# EAGLE design G803X (EAGLE 6.6.0)
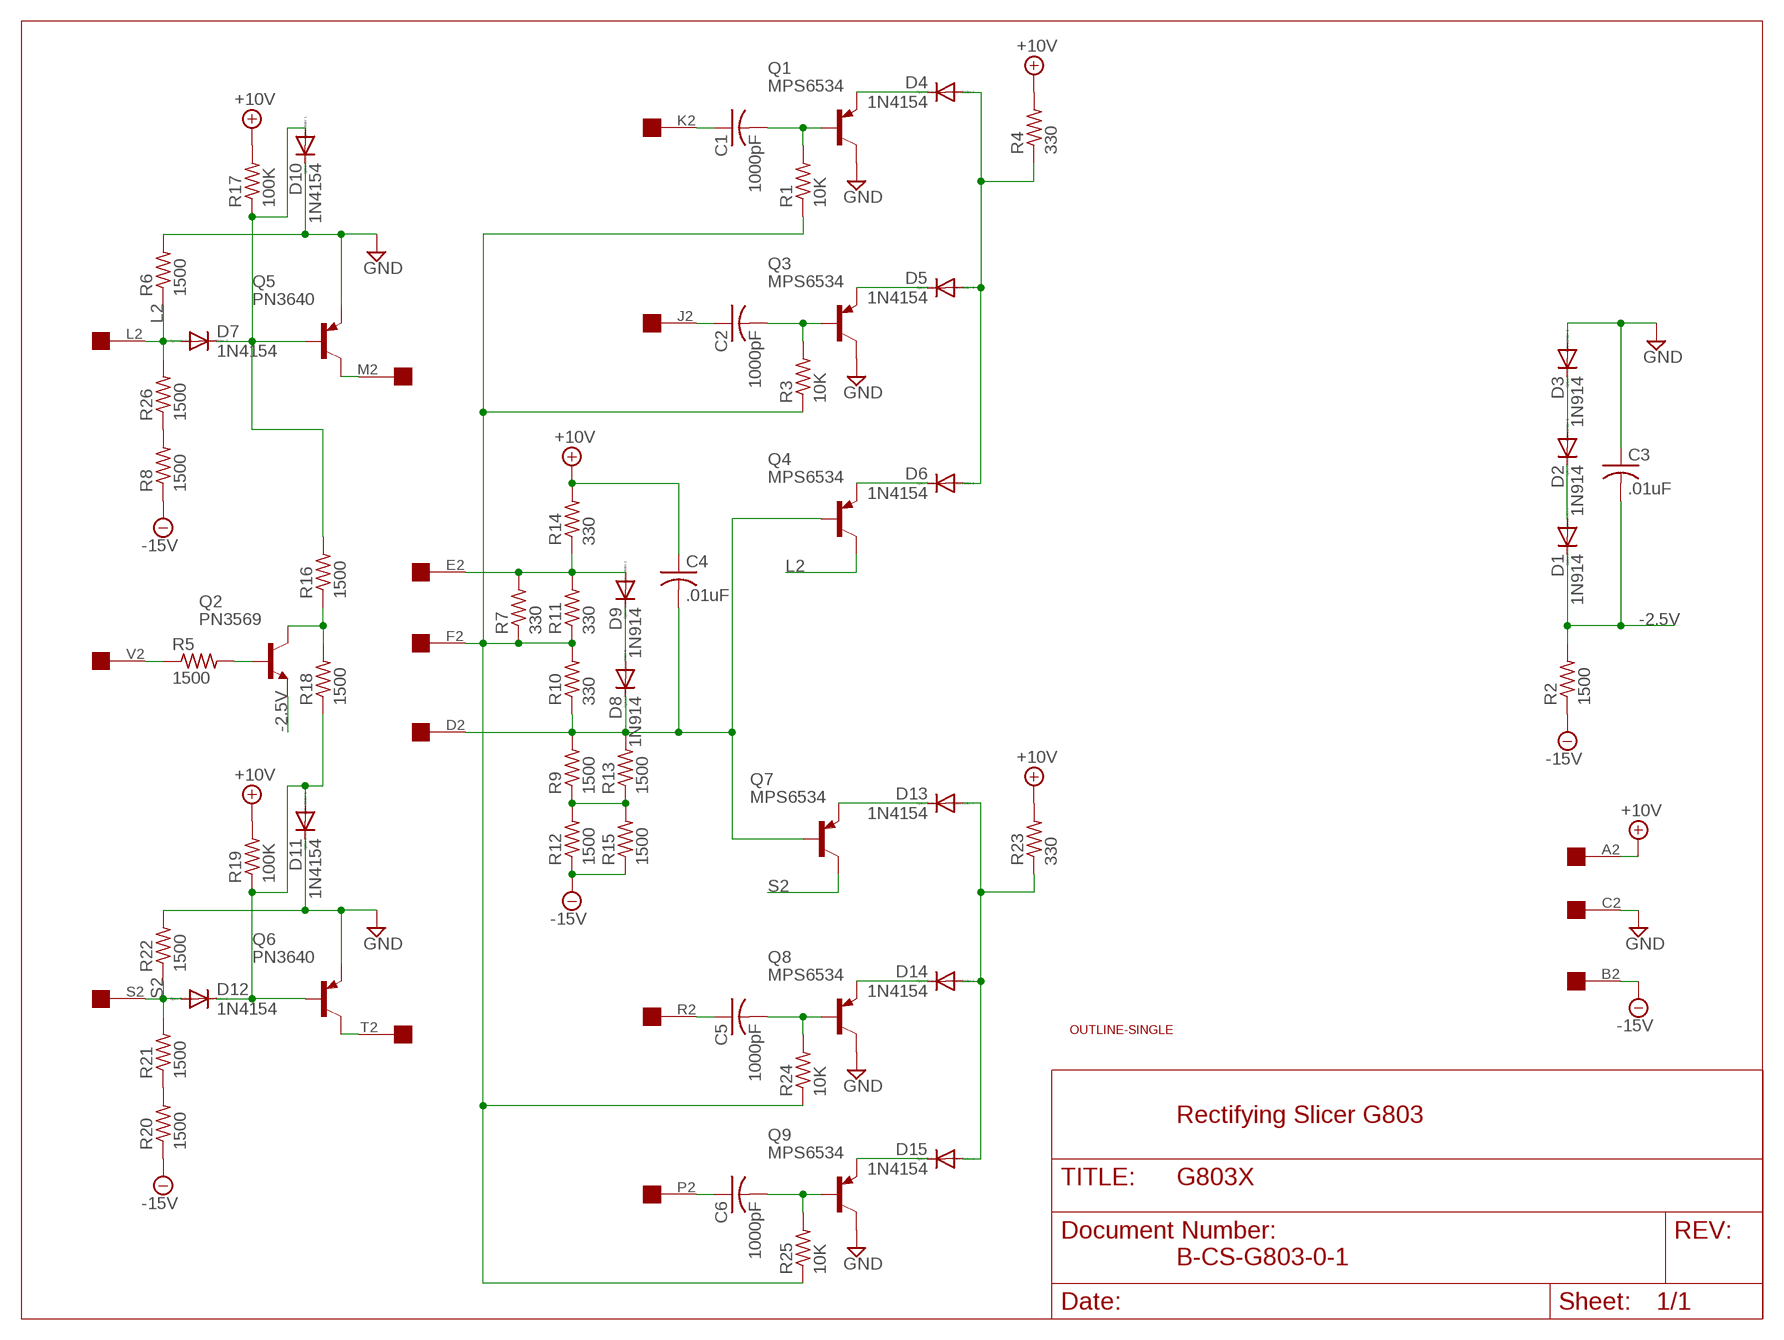
[diagram p0: schematic, sheet 1]

## Parts
C1  1000pF  C-US075-032X103  [C075-032X103]
C2  1000pF  C-US075-032X103  [C075-032X103]
C3  .01uF  C-US050-025X075  [C050-025X075]
C4  .01uF  C-US075-032X103  [C075-032X103]
C5  1000pF  C-US075-032X103  [C075-032X103]
C6  1000pF  C-US075-032X103  [C075-032X103]
D1  1N914  1N4148DO35-10  [DO35-10]
D2  1N914  1N4148DO35-10  [DO35-10]
D3  1N914  1N4148DO35-10  [DO35-10]
D4  1N4154  1N4148DO35-10  [DO35-10]
D5  1N4154  1N4148DO35-10  [DO35-10]
D6  1N4154  1N4148DO35-10  [DO35-10]
D7  1N4154  1N4148DO35-10  [DO35-10]
D8  1N914  1N4148DO35-10  [DO35-10]
D9  1N914  1N4148DO35-10  [DO35-10]
D10  1N4154  1N4148DO35-10  [DO35-10]
D11  1N4154  1N4148DO35-10  [DO35-10]
D12  1N4154  1N4148DO35-10  [DO35-10]
D13  1N4154  1N4148DO35-10  [DO35-10]
D14  1N4154  1N4148DO35-10  [DO35-10]
D15  1N4154  1N4148DO35-10  [DO35-10]
Q1  MPS6534  2N2904  [TO39]
Q2  PN3569  2N2102  [TO5]
Q3  MPS6534  2N2904  [TO39]
Q4  MPS6534  2N2904  [TO39]
Q5  PN3640  2N2904  [TO39]
Q6  PN3640  2N2904  [TO39]
Q7  MPS6534  2N2904  [TO39]
Q8  MPS6534  2N2904  [TO39]
Q9  MPS6534  2N2904  [TO39]
R1  10K  R-US_0207/10  [0207/10]
R2  1500  R-US_0207/10  [0207/10]
R3  10K  R-US_0207/10  [0207/10]
R4  330  R-US_0207/10  [0207/10]
R5  1500  R-US_0207/10  [0207/10]
R6  1500  R-US_0207/10  [0207/10]
R7  330  R-US_0207/10  [0207/10]
R8  1500  R-US_0207/10  [0207/10]
R9  1500  R-US_0207/10  [0207/10]
R10  330  R-US_0207/10  [0207/10]
R11  330  R-US_0207/10  [0207/10]
R12  1500  R-US_0207/10  [0207/10]
R13  1500  R-US_0207/10  [0207/10]
R14  330  R-US_0207/10  [0207/10]
R15  1500  R-US_0207/10  [0207/10]
R16  1500  R-US_0207/10  [0207/10]
R17  100K  R-US_0207/10  [0207/10]
R18  1500  R-US_0207/10  [0207/10]
R19  100K  R-US_0207/10  [0207/10]
R20  1500  R-US_0207/10  [0207/10]
R21  1500  R-US_0207/10  [0207/10]
R22  1500  R-US_0207/10  [0207/10]
R23  330  R-US_0207/10  [0207/10]
R24  10K  R-US_0207/10  [0207/10]
R25  10K  R-US_0207/10  [0207/10]
R26  1500  R-US_0207/10  [0207/10]
U$1  OUTLINE-SINGLE  [SINGLE]
U$2  EDGE-1  [EDGE-CON1]

## Nets
+10V: C4.1 R4.2 R14.2 R17.2 R19.2 R23.2 U$2.A2
-2.5V: C3.2 D1.C Q2.1(E) R2.2
-15V: R2.1 R8.1 R12.1 R15.1 R20.1 U$2.B2
GND [Supply]: C3.1 D3.A D10.C D11.C Q1.3(C) Q3.3(C) Q5.1(E) Q6.1(E) Q8.3(C) Q9.3(C) R6.2 R22.2 U$2.C2
L2: D7.A Q4.3(C) R6.1 R26.2 U$2.L2
N$1: C1.1 U$2.K2
N$2: R5.1 U$2.V2
N$3: C1.2 Q1.2(B) R1.2
N$4: D4.C Q1.1(E)
N$5: D5.C Q3.1(E)
N$6: C2.1 U$2.J2
N$7: D14.C Q8.1(E)
N$8: C2.2 Q3.2(B) R3.2
N$9: D15.C Q9.1(E)
N$10: Q2.2(B) R5.2
N$11: C5.1 U$2.R2
N$12: Q6.3(C) U$2.T2
N$13: C5.2 Q8.2(B) R24.2
N$14: Q5.3(C) U$2.M2
N$15: R8.2 R26.1
N$16: C6.1 U$2.P2
N$17: D13.C Q7.1(E)
N$18: C6.2 Q9.2(B) R25.2
N$19: R20.2 R21.1
N$20: D6.C Q4.1(E)
N$21: D7.C D10.A Q5.2(B) R16.2 R17.1
N$22: Q2.3(C) R16.1 R18.2
N$23: C4.2 D8.C Q4.2(B) Q7.2(B) R9.2 R10.1 R13.2 U$2.D2
N$24: D11.A D12.C Q6.2(B) R18.1 R19.1
N$25: R9.1 R12.2 R13.1 R15.2
N$26: R1.1 R3.1 R7.1 R10.2 R11.1 R24.1 R25.1 U$2.F2
N$27: D2.A D3.C
N$28: D4.A D5.A D6.A R4.1
N$29: D1.A D2.C
N$30: D8.A D9.C
N$31: D9.A R7.2 R11.2 R14.1 U$2.E2
N$32: D13.A D14.A D15.A R23.1
S2: D12.A Q7.3(C) R21.2 R22.1 U$2.S2
Unconnected: U$2.H2 U$2.N2 U$2.U2

## Notes on the sheet
- Rectifying Slicer G803
- B-CS-G803-0-1

## Library data of the parts
C1-C6 = rcl:C-US: CAPACITOR, American symbol
D1-D15 = diode:1N4148: DIODE high speed (Philips)
Q1 Q3-Q9 = transistor-pnp:2N2904*: PNP Transistror
Q2 = transistor:2N2102: NPN TRANSISTOR
R1-R26 = rcl:R-US_: RESISTOR, American symbol
U$1 = dec-con:OUTLINE-*: Board outlines for DEC boards.
U$2 = dec-con:EDGE-1: Single-Sided DEC Edge Connector -- (side 2)

## Net classes
1 Supply: width 0.813 mm

## Board
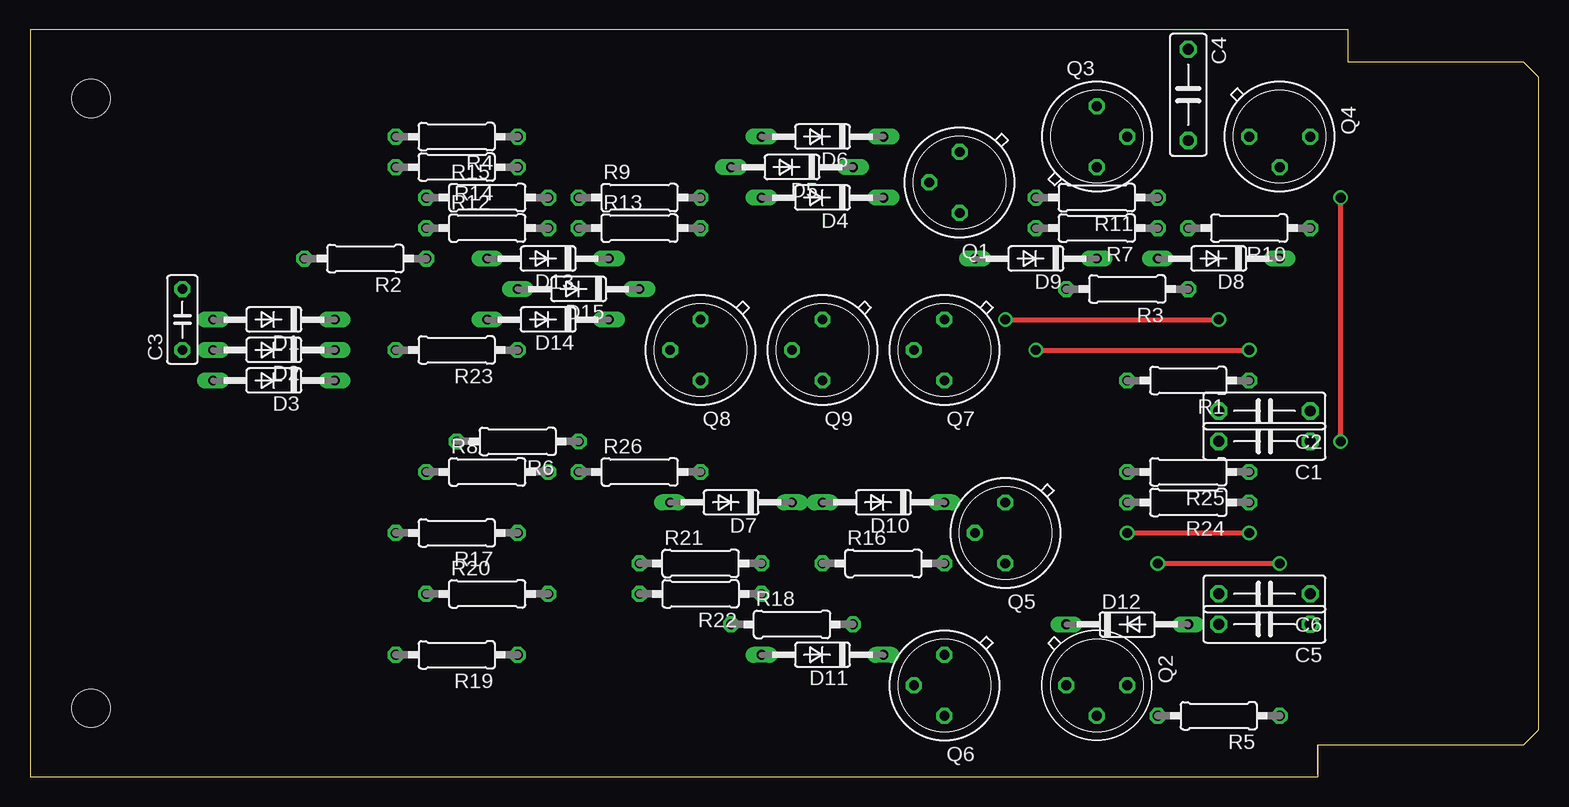
[diagram p1: board, top side]
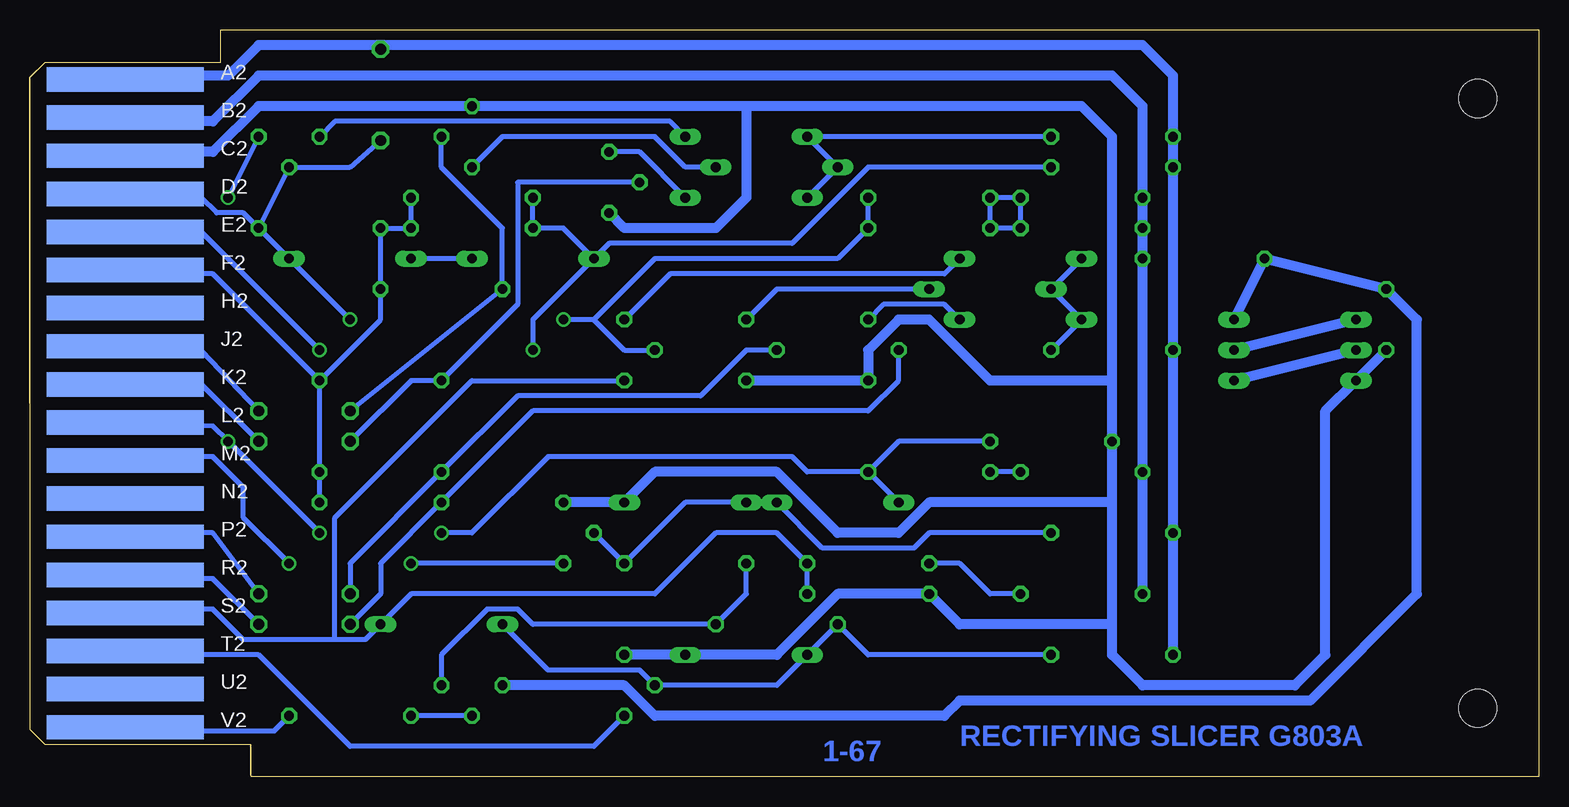
[diagram p2: board, bottom side, seen from below]

Size 125.73 x 62.23 mm. Coordinates in mm from the lower left corner, seen from the top.
Copper layers (1+16): Top 0.035mm / dielectric 1.5mm / Bottom 0.035mm
Design rules "16mils": minimum track width 16mil, minimum drill 32mil, track to track 15mil, track to pad 10mil, pad to pad 10mil, via to via 10mil, smd to smd 10mil, copper to edge 13mil, drill to drill 10mil, minimum pad ring 10mil, minimum via ring 8mil, stop-mask expansion 0mil, vias tented up to drill 0mil, thermal gap 10mil

### Footprints (pad centres in the part's own frame; a part is rotated, then mirrored left to right if it is on the bottom)
C075-032X103 = drill 0.914 octagon: 1 -3.81,0; 2 3.81,0
C050-025X075 = drill 0.813 octagon: 1 -2.54,0; 2 2.54,0
DO35-10 = drill 0.813 long: A 5.08,0; C -5.08,0
TO39 = drill 0.813 octagon: 1 0,-2.54; 2 2.54,0; 3 0,2.54
TO5 = drill 0.813 octagon: 1 0,-2.54; 2 2.54,0; 3 0,2.54
0207/10 = drill 0.813 octagon: 1 -5.08,0; 2 5.08,0
SINGLE = hole 3.175: 120.65,56.515; 120.65,5.715
EDGE-CON1 = smd 13.106 x 2.032 bottom: A2 7.938,4.128; B2 7.938,7.303; C2 7.938,10.477; D2 7.938,13.652; E2 7.938,16.828; F2 7.938,20.003; H2 7.938,23.177; J2 7.938,26.352; K2 7.938,29.527; L2 7.938,32.703; M2 7.938,35.877; N2 7.938,39.053; P2 7.938,42.227; R2 7.938,45.403; S2 7.938,48.578; T2 7.938,51.752; U2 7.938,54.928; V2 7.938,58.102

### Placement (x,y rotation side)
C1  102.87,27.94 180 top
C2  102.87,30.48 180 top
C3  12.7,38.1 90 top
C4  96.52,56.83 270 top
C5  102.87,12.7 180 top
C6  102.87,15.24 180 top
D1  20.32,38.1 180 top
D2  20.32,35.56 180 top
D3  20.32,33.02 180 top
D4  66.04,48.26 180 top
D5  63.5,50.8 180 top
D6  66.04,53.34 180 top
D7  58.42,22.86 180 top
D8  99.06,43.18 180 top
D9  83.82,43.18 180 top
D10  71.12,22.86 180 top
D11  66.04,10.16 180 top
D12  91.44,12.7 0 top
D13  43.18,43.18 180 top
D14  43.18,38.1 180 top
D15  45.72,40.64 180 top
Q1  77.47,49.53 180 top
Q2  88.9,7.62 270 top
Q3  88.9,53.34 0 top
Q4  104.14,53.34 270 top
Q5  81.28,20.32 180 top
Q6  76.2,7.62 180 top
Q7  76.2,35.56 180 top
Q8  55.88,35.56 180 top
Q9  66.04,35.56 180 top
R1  96.52,33.02 180 top
R2  27.94,43.18 180 top
R3  91.44,40.64 180 top
R4  35.56,53.34 180 top
R5  99.06,5.08 180 top
R6  40.64,27.94 180 top
R7  88.9,45.72 180 top
R8  38.1,25.4 0 top
R9  50.8,48.26 0 top
R10  101.6,45.72 180 top
R11  88.9,48.26 180 top
R12  38.1,45.72 0 top
R13  50.8,45.72 0 top
R14  35.56,50.8 180 top
R15  38.1,48.26 0 top
R16  71.12,17.78 0 top
R17  35.56,20.32 180 top
R18  63.5,12.7 0 top
R19  35.56,10.16 180 top
R20  38.1,15.24 0 top
R21  55.88,17.78 0 top
R22  55.88,15.24 180 top
R23  35.56,35.56 180 top
R24  96.52,22.86 180 top
R25  96.52,25.4 180 top
R26  50.8,25.4 0 top
U$1  125.73,62.23 180 top
U$2  125.73,62.23 180 top

### Tracks (layer width: path | path; a pad name or v marks a point on that pad's centre or on a via)
+10V
  Bottom 0.813: U$2.A2 116.84,58.04 116.84,58.42 109.22,58.42 106.68,60.96 96.52,60.96 | 96.52,60.96 33.02,60.96 30.48,58.42 R4.2 R14.2 R23.2 R17.2 R19.2 | 96.52,60.96 C4.1
-2.5V
  Bottom 0.813: D1.C R2.2 C3.2 10.16,38.1 10.16,15.24 19.05,6.35 48.26,6.35 49.53,5.08 73.66,5.08 76.2,7.62 Q2.1
-15V
  Bottom 0.813: U$2.B2 117.13,54.9 116.84,54.61 110.49,54.61 106.68,58.42 35.56,58.42 33.02,55.88 R15.1 R12.1 R2.1 R8.1 R20.1
GND
  Bottom 0.813: U$2.C2 117.17,51.74 116.84,52.07 110.49,52.07 106.68,55.88 Q3.3 66.04,55.88 | 66.04,55.88 38.1,55.88 35.56,53.34 35.56,33.02 | C3.1 D3.A 17.78,30.48 17.78,10.16 20.32,7.62 33.02,7.62 35.56,10.16 35.56,12.7 | 35.56,12.7 35.56,22.86 | 35.56,22.86 R6.2 35.56,33.02 | Q6.1 D11.C 63.5,10.16 58.42,15.24 R22.2 48.26,12.7 35.56,12.7 | Q9.3 Q8.3 55.88,35.56 53.34,38.1 50.8,38.1 45.72,33.02 35.56,33.02 | 66.04,55.88 66.04,48.26 68.58,45.72 76.2,45.72 Q1.3 | Q5.1 D10.C 73.66,25.4 63.5,25.4 58.42,20.32 53.34,20.32 50.8,22.86 35.56,22.86
L2  (via drill 0.81)
  Top 0.406: v91.44,20.32 v101.6,20.32 | v109.22,27.94 v109.22,48.26
  Bottom 0.406: U$2.L2 110.49,29.21 v109.22,27.94 v101.6,20.32 | v109.22,48.26 Q4.3 | R6.1 53.34,27.94 R26.2 | R26.2 D7.A | R26.2 60.96,25.4 62.23,26.67 82.55,26.67 88.9,20.32 v91.44,20.32
N$1
  Bottom 0.406: U$2.K2 116.84,33.02 111.76,33.02 C1.1
N$2
  Bottom 0.406: U$2.V2 116.84,3.81 105.41,3.81 R5.1
N$3
  Bottom 0.406: C1.2 93.98,33.02 R1.2 85.09,39.37 85.09,49.53 Q1.2
N$4
  Bottom 0.406: D4.C 74.93,52.07 Q1.1
N$5
  Bottom 0.406: D5.C 71.12,50.8 73.66,53.34 86.36,53.34 Q3.1
N$6
  Bottom 0.406: U$2.J2 116.84,35.56 111.44,35.56 C2.1
N$7
  Bottom 0.406: D14.C 49.53,39.37 54.61,39.37 Q8.1
N$8
  Bottom 0.406: C2.2 R3.2 86.36,45.72 91.44,50.8 Q3.2
N$9
  Bottom 0.406: D15.C 63.5,40.64 Q9.1
N$10
  Bottom 0.406: Q2.2 R5.2
N$11
  Bottom 0.406: U$2.R2 116.84,16.51 110.49,16.51 C5.1
N$12
  Bottom 0.406: U$2.T2 116.84,10.16 106.68,10.16 99.06,2.54 78.74,2.54 Q6.3
N$13
  Bottom 0.406: C5.2 96.52,15.24 96.52,17.78 R24.2 83.82,30.48 55.88,30.48 53.34,33.02 Q8.2
N$14  (via drill 0.81)
  Top 0.406: v93.98,17.78 v104.14,17.78
  Bottom 0.406: U$2.M2 116.84,26.67 110.49,26.67 107.95,24.13 107.95,21.59 v104.14,17.78 | Q5.3 v93.98,17.78
N$15
  Bottom 0.406: R8.2 R26.1
N$16
  Bottom 0.406: U$2.P2 116.84,20.32 110.49,20.32 C6.1
N$17
  Bottom 0.406: D13.C 49.53,41.91 72.39,41.91 Q7.1
N$18
  Bottom 0.406: C6.2 99.06,17.78 R25.2 85.09,31.75 69.85,31.75 66.04,35.56 Q9.2
N$19
  Bottom 0.406: R20.2 45.72,15.24 48.26,17.78 R21.1
N$20
  Bottom 0.406: Q4.1 100.33,54.61 72.39,54.61 D6.C
N$21
  Bottom 0.406: R17.1 50.8,20.32 52.07,19.05 59.69,19.05 D7.C D10.A 71.12,22.86 R16.2 Q5.2
N$22
  Bottom 0.406: R16.1 66.04,15.24 R18.2 83.82,12.7 85.09,13.97 87.63,13.97 91.44,10.16 Q2.3
N$23  (via drill 0.81)
  Top 0.406: v81.28,38.1 v99.06,38.1
  Bottom 0.406: U$2.D2 116.84,48.26 111.44,48.26 110.17,46.99 107.95,46.99 R10.1 | R10.1 Q4.2 99.06,50.8 C4.2 | R10.1 D8.C v99.06,38.1 | Q7.2 76.2,35.56 78.74,38.1 | 78.74,38.1 v81.28,38.1 | R9.2 R13.2 58.42,43.18 73.66,43.18 78.74,38.1
N$24
  Bottom 0.406: D12.C 82.55,8.89 74.93,8.89 Q6.2 63.5,7.62 D11.A R18.1 55.88,10.16 R19.1
N$25
  Bottom 0.406: R12.2 R15.2 R9.1 R13.1 R12.2
N$26
  Bottom 0.406: U$2.F2 116.84,41.91 110.49,41.91 R1.1 | R1.1 96.52,38.1 R3.1 R10.2 R7.1 R11.1 | R24.1 R25.1 R1.1
N$27
  Bottom 0.813: D2.A D3.C
N$28
  Bottom 0.406: R4.1 D6.A D5.A D4.A
N$29
  Bottom 0.813: D1.A D2.C
N$30
  Bottom 0.406: D9.C D8.A
N$31  (via drill 0.81)
  Top 0.406: v83.82,35.56 v101.6,35.56
  Bottom 0.406: U$2.E2 116.84,45.72 111.76,45.72 v101.6,35.56 | v83.82,35.56 83.82,38.1 D9.A | R11.2 R7.2 81.28,45.72 D9.A | R14.1 55.88,50.8 62.23,44.45 77.47,44.45 D9.A
N$32
  Bottom 0.406: R23.1 D14.A D15.A D13.A
S2
  Bottom 0.406: U$2.S2 116.84,13.97 110.49,13.97 107.95,11.43 100.33,11.43 | 100.33,11.43 97.79,11.43 D12.A 93.98,15.24 73.66,15.24 68.58,20.32 63.5,20.32 R21.2 R22.1 | Q7.3 88.9,33.02 100.33,21.59 100.33,11.43

### Text on the board
Bottom: RECTIFYING SLICER G803A | 1-67